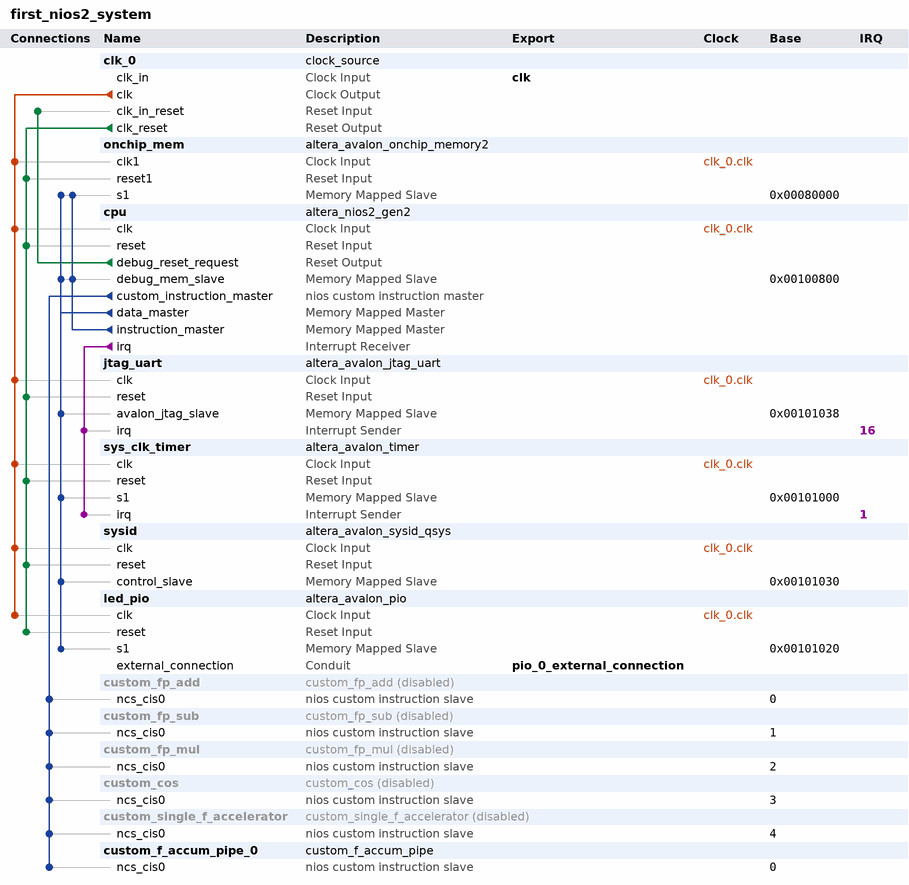
[diagram p0: system contents]
# Platform Designer (Qsys) system first_nios2_system, Cyclone V 5CSEMA5F31C6
# Parameters at their usual value, and those the tool derives, are not listed.
package require -exact qsys 23.1
create_system first_nios2_system
set_project_property DEVICE_FAMILY {Cyclone V}
set_project_property DEVICE 5CSEMA5F31C6

add_instance clk_0 clock_source 23.1
set_instance_parameter_value clk_0 clockFrequency 50000000

add_instance onchip_mem altera_avalon_onchip_memory2 23.1
set_instance_parameter_value onchip_mem dataWidth 32
set_instance_parameter_value onchip_mem dualPort false
set_instance_parameter_value onchip_mem initMemContent true
set_instance_parameter_value onchip_mem initializationFileName onchip_mem.hex
set_instance_parameter_value onchip_mem memorySize 389120

add_instance cpu altera_nios2_gen2 23.1
set_instance_parameter_value cpu dcache_size 2048
set_instance_parameter_value cpu exceptionSlave onchip_mem.s1
set_instance_parameter_value cpu icache_size 2048
set_instance_parameter_value cpu impl Fast
set_instance_parameter_value cpu mul_32_impl 0
set_instance_parameter_value cpu mul_shift_choice 1
set_instance_parameter_value cpu resetSlave onchip_mem.s1

add_instance jtag_uart altera_avalon_jtag_uart 23.1
set_instance_parameter_value jtag_uart simInteractiveOptions NO_INTERACTIVE_WINDOWS

add_instance sys_clk_timer altera_avalon_timer 23.1
set_instance_parameter_value sys_clk_timer period 2
set_instance_parameter_value sys_clk_timer periodUnits MSEC

add_instance sysid altera_avalon_sysid_qsys 23.1
set_instance_parameter_value sysid id 0

add_instance led_pio altera_avalon_pio 23.1
set_instance_parameter_value led_pio direction Output
set_instance_parameter_value led_pio width 8

add_instance custom_fp_add custom_fp_add 1.0
set_instance_property custom_fp_add ENABLED false
set_instance_parameter_value custom_fp_add ADD_LATENCY 3

add_instance custom_fp_sub custom_fp_sub 1.0
set_instance_property custom_fp_sub ENABLED false
set_instance_parameter_value custom_fp_sub SUB_LATENCY 3

add_instance custom_fp_mul custom_fp_mul 1.0
set_instance_property custom_fp_mul ENABLED false
set_instance_parameter_value custom_fp_mul MUL_LATENCY 3

add_instance custom_cos custom_cos 1.0
set_instance_property custom_cos ENABLED false
set_instance_parameter_value custom_cos CORDIC_FRAC 22
set_instance_parameter_value custom_cos CORDIC_ITER 18
set_instance_parameter_value custom_cos CORDIC_ITER_PER_CYCLE 1
set_instance_parameter_value custom_cos CORDIC_W 28
set_instance_parameter_value custom_cos FX_FRAC 22
set_instance_parameter_value custom_cos FX_W 40

add_instance custom_single_f_accelerator custom_single_f_accelerator 1.0
set_instance_property custom_single_f_accelerator ENABLED false
set_instance_parameter_value custom_single_f_accelerator ADD_LATENCY 3
set_instance_parameter_value custom_single_f_accelerator CORDIC_FRAC 22
set_instance_parameter_value custom_single_f_accelerator CORDIC_ITER 18
set_instance_parameter_value custom_single_f_accelerator CORDIC_ITER_PER_CYCLE 3
set_instance_parameter_value custom_single_f_accelerator CORDIC_W 28
set_instance_parameter_value custom_single_f_accelerator FX_FRAC 22
set_instance_parameter_value custom_single_f_accelerator FX_W 40
set_instance_parameter_value custom_single_f_accelerator MUL_LATENCY 3

add_instance custom_f_accum_pipe_0 custom_f_accum_pipe 1.0
set_instance_parameter_value custom_f_accum_pipe_0 ADD_LATENCY 3
set_instance_parameter_value custom_f_accum_pipe_0 CORDIC_FRAC 22
set_instance_parameter_value custom_f_accum_pipe_0 CORDIC_ITER 18
set_instance_parameter_value custom_f_accum_pipe_0 CORDIC_W 28
set_instance_parameter_value custom_f_accum_pipe_0 FX_FRAC 22
set_instance_parameter_value custom_f_accum_pipe_0 FX_W 40
set_instance_parameter_value custom_f_accum_pipe_0 MUL_LATENCY 3
set_instance_parameter_value custom_f_accum_pipe_0 X3_FIFO_DEPTH 32

# connections
add_connection clk_0.clk cpu.clk clock
add_connection clk_0.clk jtag_uart.clk clock
add_connection clk_0.clk led_pio.clk clock
add_connection clk_0.clk onchip_mem.clk1 clock
add_connection clk_0.clk sys_clk_timer.clk clock
add_connection clk_0.clk sysid.clk clock
add_connection clk_0.clk_reset cpu.reset reset
add_connection clk_0.clk_reset jtag_uart.reset reset
add_connection clk_0.clk_reset led_pio.reset reset
add_connection clk_0.clk_reset onchip_mem.reset1 reset
add_connection clk_0.clk_reset sys_clk_timer.reset reset
add_connection clk_0.clk_reset sysid.reset reset
add_connection cpu.debug_reset_request clk_0.clk_in_reset reset
add_connection cpu.data_master cpu.debug_mem_slave avalon
set_connection_parameter_value cpu.data_master/cpu.debug_mem_slave baseAddress 0x00100800
add_connection cpu.data_master jtag_uart.avalon_jtag_slave avalon
set_connection_parameter_value cpu.data_master/jtag_uart.avalon_jtag_slave baseAddress 0x00101038
add_connection cpu.data_master led_pio.s1 avalon
set_connection_parameter_value cpu.data_master/led_pio.s1 baseAddress 0x00101020
add_connection cpu.data_master onchip_mem.s1 avalon
set_connection_parameter_value cpu.data_master/onchip_mem.s1 baseAddress 0x00080000
add_connection cpu.data_master sys_clk_timer.s1 avalon
set_connection_parameter_value cpu.data_master/sys_clk_timer.s1 baseAddress 0x00101000
add_connection cpu.data_master sysid.control_slave avalon
set_connection_parameter_value cpu.data_master/sysid.control_slave baseAddress 0x00101030
add_connection cpu.instruction_master cpu.debug_mem_slave avalon
set_connection_parameter_value cpu.instruction_master/cpu.debug_mem_slave baseAddress 0x00100800
add_connection cpu.instruction_master onchip_mem.s1 avalon
set_connection_parameter_value cpu.instruction_master/onchip_mem.s1 baseAddress 0x00080000
add_connection cpu.irq jtag_uart.irq interrupt
set_connection_parameter_value cpu.irq/jtag_uart.irq irqNumber 16
add_connection cpu.irq sys_clk_timer.irq interrupt
set_connection_parameter_value cpu.irq/sys_clk_timer.irq irqNumber 1
add_connection cpu.custom_instruction_master custom_cos.ncs_cis0 nios_custom_instruction
set_connection_parameter_value cpu.custom_instruction_master/custom_cos.ncs_cis0 CIName custom_cos
set_connection_parameter_value cpu.custom_instruction_master/custom_cos.ncs_cis0 baseAddress 3
add_connection cpu.custom_instruction_master custom_f_accum_pipe_0.ncs_cis0 nios_custom_instruction
set_connection_parameter_value cpu.custom_instruction_master/custom_f_accum_pipe_0.ncs_cis0 CIName custom_f_accum_pipe_0
set_connection_parameter_value cpu.custom_instruction_master/custom_f_accum_pipe_0.ncs_cis0 baseAddress 0
add_connection cpu.custom_instruction_master custom_fp_add.ncs_cis0 nios_custom_instruction
set_connection_parameter_value cpu.custom_instruction_master/custom_fp_add.ncs_cis0 CIName custom_fp_add_0
set_connection_parameter_value cpu.custom_instruction_master/custom_fp_add.ncs_cis0 baseAddress 0
add_connection cpu.custom_instruction_master custom_fp_mul.ncs_cis0 nios_custom_instruction
set_connection_parameter_value cpu.custom_instruction_master/custom_fp_mul.ncs_cis0 CIName custom_fp_mul_0
set_connection_parameter_value cpu.custom_instruction_master/custom_fp_mul.ncs_cis0 baseAddress 2
add_connection cpu.custom_instruction_master custom_fp_sub.ncs_cis0 nios_custom_instruction
set_connection_parameter_value cpu.custom_instruction_master/custom_fp_sub.ncs_cis0 CIName custom_fp_sub_0
set_connection_parameter_value cpu.custom_instruction_master/custom_fp_sub.ncs_cis0 baseAddress 1
add_connection cpu.custom_instruction_master custom_single_f_accelerator.ncs_cis0 nios_custom_instruction
set_connection_parameter_value cpu.custom_instruction_master/custom_single_f_accelerator.ncs_cis0 CIName custom_single_f_accelerator_0
set_connection_parameter_value cpu.custom_instruction_master/custom_single_f_accelerator.ncs_cis0 baseAddress 4

# exported interfaces
add_interface clk clock sink
set_interface_property clk EXPORT_OF clk_0.clk_in
add_interface pio_0_external_connection conduit end
set_interface_property pio_0_external_connection EXPORT_OF led_pio.external_connection

set_interconnect_requirement {$system} qsys_mm.clockCrossingAdapter HANDSHAKE
set_interconnect_requirement {$system} qsys_mm.enableEccProtection FALSE
set_interconnect_requirement {$system} qsys_mm.insertDefaultSlave FALSE
set_interconnect_requirement {$system} qsys_mm.maxAdditionalLatency 1

save_system first_nios2_system.qsys
